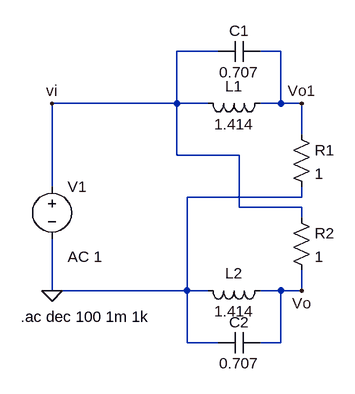
[diagram p0: schematic Ej2-c.asc]
Ej2-c.asc, the LTspice schematic file:
Version 4
SHEET 1 880 680
WIRE -16 48 -80 48
WIRE 80 48 48 48
WIRE -80 128 -80 48
WIRE -80 128 -272 128
WIRE -32 128 -80 128
WIRE 80 128 80 48
WIRE 80 128 48 128
WIRE 112 128 80 128
WIRE 112 176 112 128
WIRE -80 208 -80 128
WIRE 16 208 -80 208
WIRE -272 256 -272 128
WIRE 112 272 112 256
WIRE 112 272 -64 272
WIRE 16 288 16 208
WIRE 112 288 16 288
WIRE 112 304 112 288
WIRE -272 416 -272 336
WIRE -64 416 -64 272
WIRE -64 416 -272 416
WIRE -32 416 -64 416
WIRE 80 416 48 416
WIRE 112 416 112 384
WIRE 112 416 80 416
WIRE -64 496 -64 416
WIRE -16 496 -64 496
WIRE 80 496 80 416
WIRE 80 496 48 496
FLAG -272 128 vi
FLAG 112 128 Vo1
FLAG 112 416 Vo
FLAG -272 416 0
SYMBOL voltage -272 240 R0
WINDOW 123 24 124 Left 2
WINDOW 39 0 0 Left 0
SYMATTR Value2 AC 1
SYMATTR InstName V1
SYMATTR Value ""
SYMBOL ind 64 112 R90
WINDOW 0 5 56 VBottom 2
WINDOW 3 32 56 VTop 2
SYMATTR InstName L1
SYMATTR Value 1.414
SYMBOL ind 64 400 R90
WINDOW 0 5 56 VBottom 2
WINDOW 3 32 56 VTop 2
SYMATTR InstName L2
SYMATTR Value 1.414
SYMBOL res 96 160 R0
SYMATTR InstName R1
SYMATTR Value 1
SYMBOL res 96 288 R0
SYMATTR InstName R2
SYMATTR Value 1
SYMBOL cap 48 32 R90
WINDOW 0 0 32 VBottom 2
WINDOW 3 32 32 VTop 2
SYMATTR InstName C1
SYMATTR Value 0.707
SYMBOL cap 48 480 R90
WINDOW 0 0 32 VBottom 2
WINDOW 3 32 32 VTop 2
SYMATTR InstName C2
SYMATTR Value 0.707
TEXT -320 456 Left 2 !.ac dec 100 1m 1k

The netlist it stands for:
* Ej2-c.asc
V1 vi 0 AC 1
L1 Vo1 vi 1.414
L2 Vo 0 1.414
R1 Vo1 0 1
R2 vi Vo 1
C1 Vo1 vi 0.707
C2 Vo 0 0.707
.ac dec 100 1m 1k
.backanno
.end

* Results of the author's LTspice run, read from the files saved beside the schematic
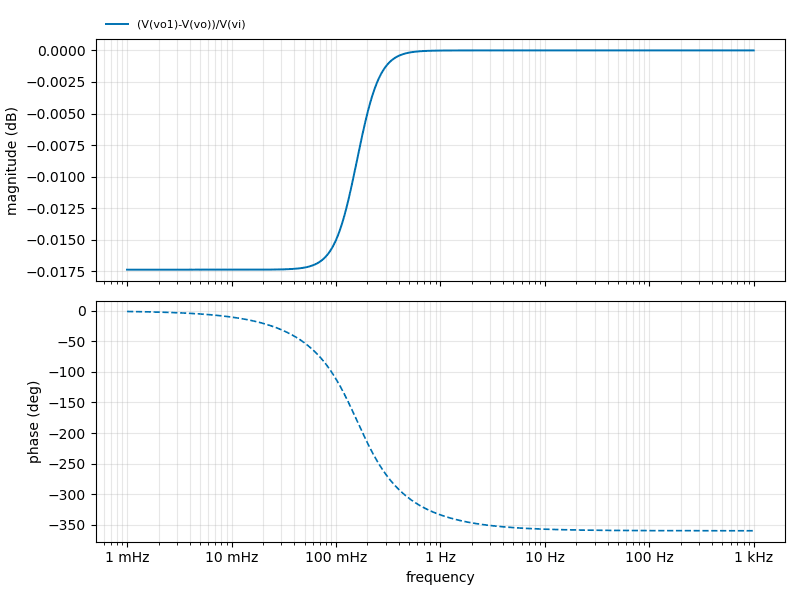
[diagram p1: AC Analysis of Ej2-c.asc, plotted from the saved traces]
* AC Analysis, 1 run:
*   (V(vo1)-V(vo))/V(vi): -0.02 dB at 1 mHz, -0.00 dB at 1 kHz, peak 0.00 dB at 489.8 Hz